# Altium schematic sheet Sheet1.SchDoc
size A3
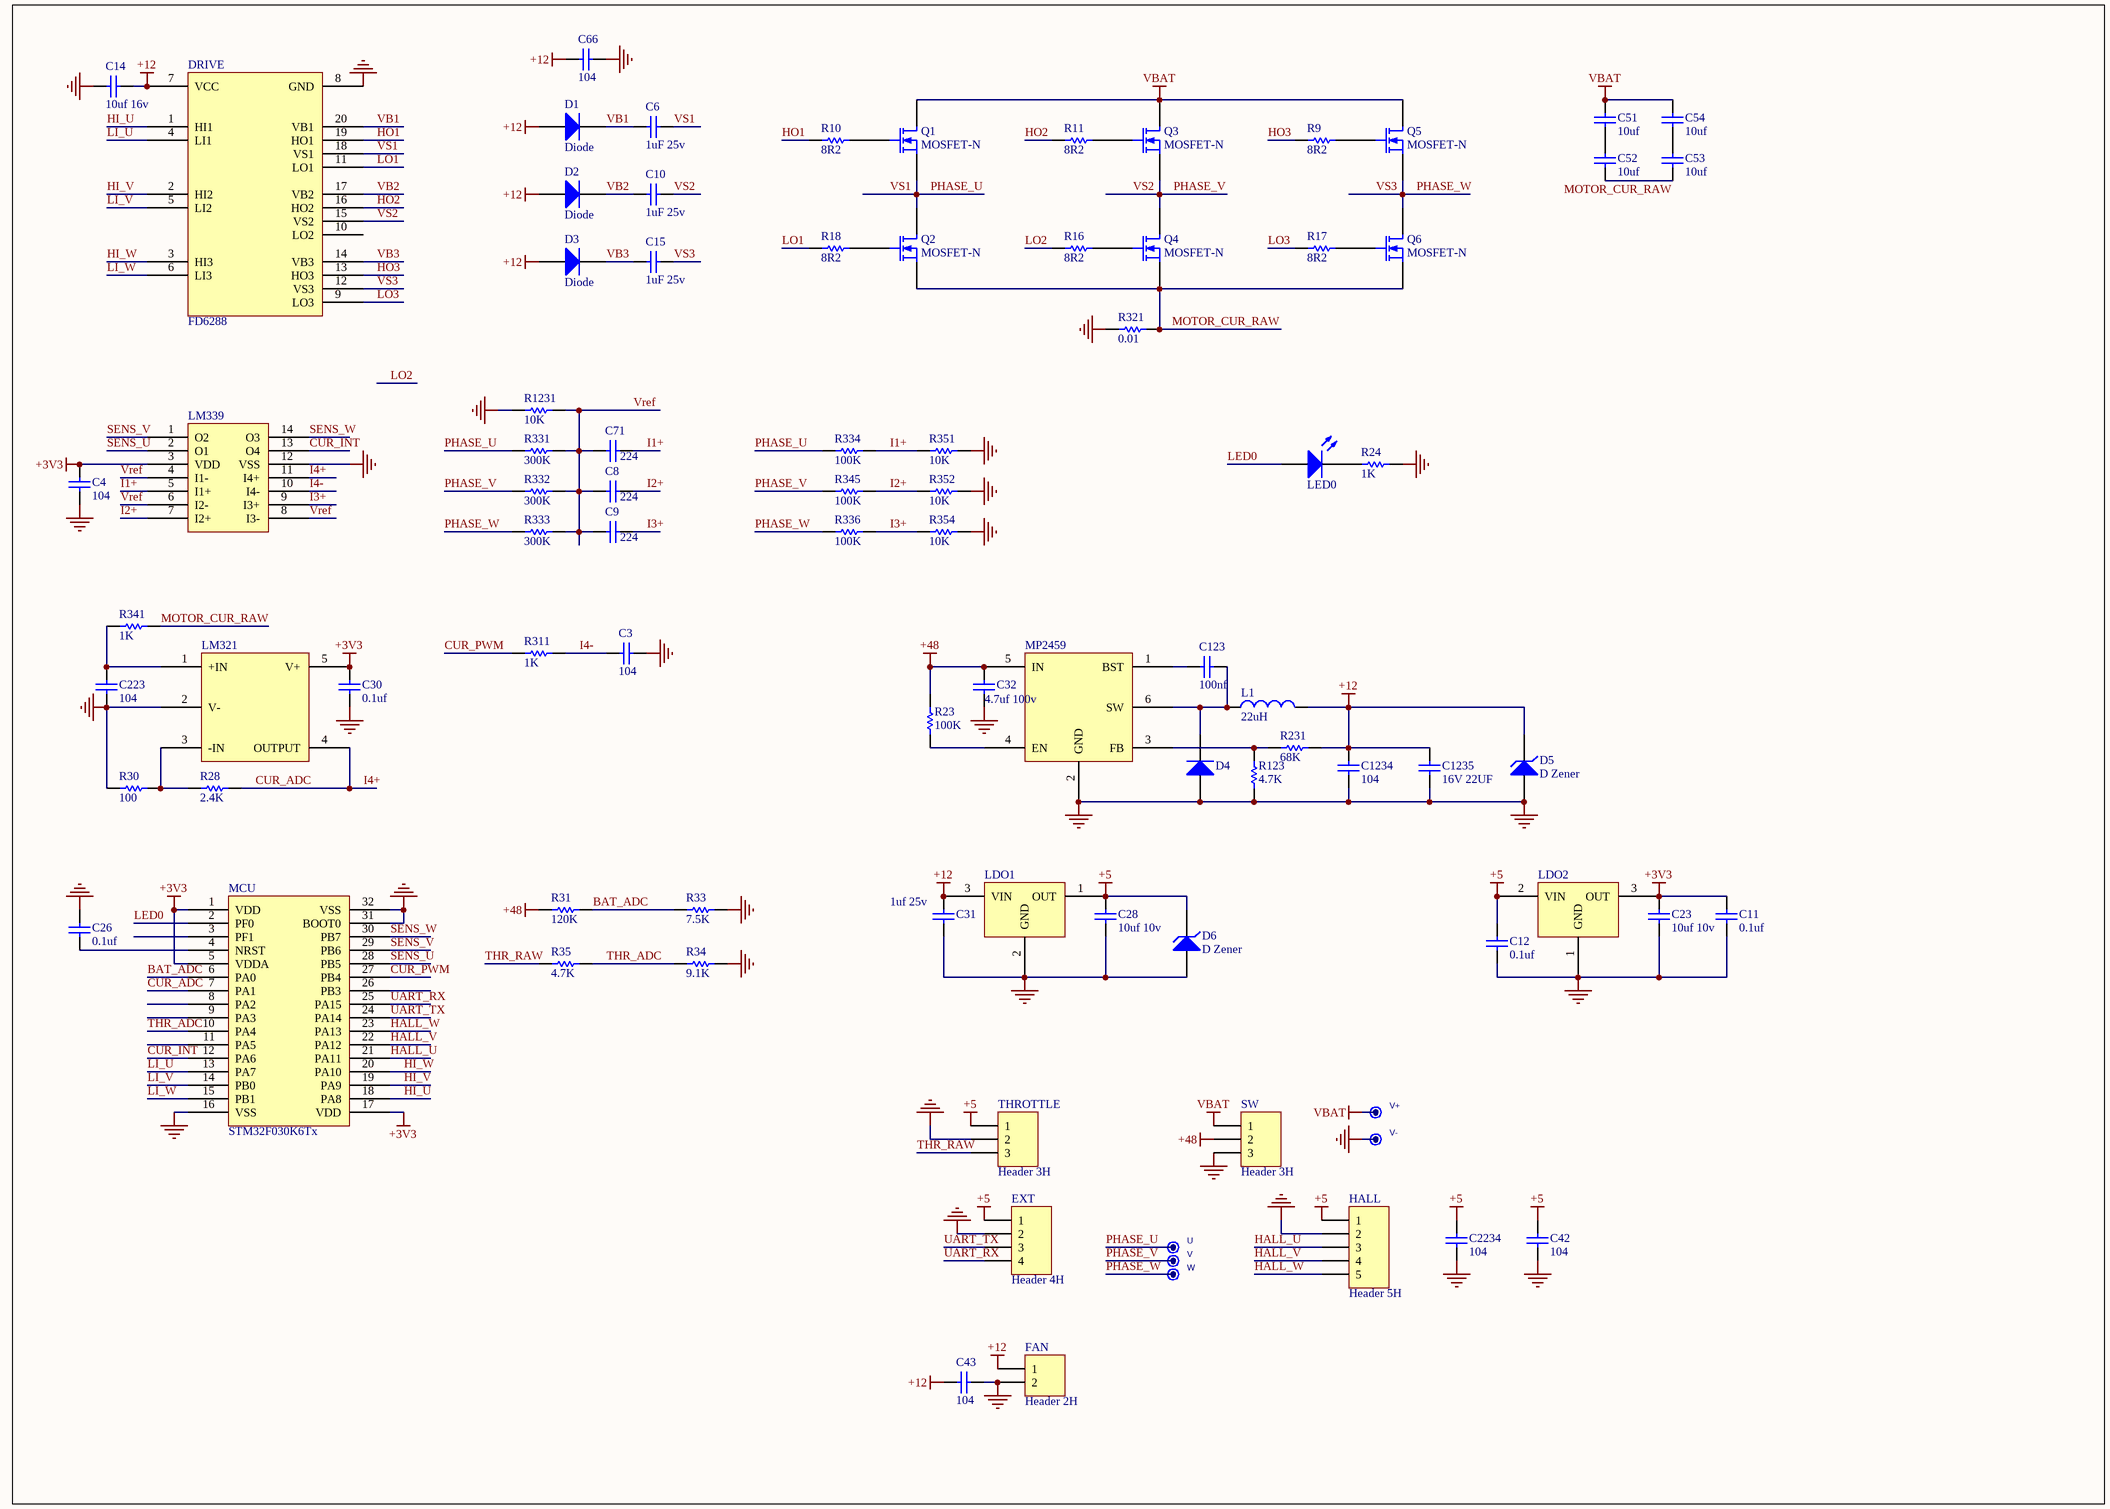
[diagram p0: Sheet1.SchDoc]

## Parts
C3  value 104  [0603]  (hidden comment: Cap)
C4  value 104  [0603]  (hidden comment: Cap)
C6  value 1uF 25v  [0603]  (hidden comment: Cap)
C8  value 224  [0603]  (hidden comment: Cap)
C9  value 224  [0603]  (hidden comment: Cap)
C10  value 1uF 25v  [0603]  (hidden comment: Cap)
C11  value 0.1uf  [0603]  (hidden comment: Cap)
C12  value 0.1uf  [0603]  (hidden comment: Cap)
C14  value 10uf 16v  [0603]  (hidden comment: Cap)
C15  value 1uF 25v  [0603]  (hidden comment: Cap)
C23  value 10uf 10v  [0603]  (hidden comment: Cap)
C26  value 0.1uf  [0603]  (hidden comment: Cap)
C28  value 10uf 10v  [0603]  (hidden comment: Cap)
C30  value 0.1uf  [0603]  (hidden comment: Cap)
C31  value 1uf 25v  [0603]  (hidden comment: Cap)
C32  value 4.7uf 100v  [1206]  (hidden comment: Cap)
C42  value 104  [0603]  (hidden comment: Cap)
C43  value 104  [0603]  (hidden comment: Cap)
C51  value 10uf  [1206]  (hidden comment: Cap)
C52  value 10uf  [1206]  (hidden comment: Cap)
C53  value 10uf  [1206]  (hidden comment: Cap)
C54  value 10uf  [1206]  (hidden comment: Cap)
C66  value 104  [0603]  (hidden comment: Cap)
C71  value 224  [0603]  (hidden comment: Cap)
C123  value 100nf  [0603]  (hidden comment: Cap)
C223  value 104  [0603]  (hidden comment: Cap)
C1234  value 104  [0603]  (hidden comment: Cap)
C1235  value 16V 22UF  [1206]  (hidden comment: Cap)
C2234  value 104  [0603]  (hidden comment: Cap)
D1  Diode  [0603]
D2  Diode  [0603]
D3  Diode  [0603]
D4  Diode  [1206]  (value not drawn)
D5  D Zener  [1206]
D6  D Zener  [1206]
DRIVE  FD6288  [TSSOP20]
EXT  Header 4H  [HDR1X4H]
FAN  Header 2H  [HDR1X2H]
HALL  Header 5H  [HDR1X5H]
L1  value 22uH  [CDRH4D28]  (hidden comment: Inductor)
LDO1  78L05  [SOT-89]  (value not drawn)
LDO2  XC6206  [SOT23]  (value not drawn)
LED  LED0  [0603]
LM321  LM321  [SOT23-5]  (value not drawn)
LM339  LM339  [SOP14]  (value not drawn)
MCU  STM32F030K6Tx  [LQFP-32]
MP2459  MP2459  [SOT23-6]  (value not drawn)
Q1  MOSFET-N  [TO220-MIX]
Q2  MOSFET-N  [TO220-MIX]
Q3  MOSFET-N  [TO220-MIX]
Q4  MOSFET-N  [TO220-MIX]
Q5  MOSFET-N  [TO220-MIX]
Q6  MOSFET-N  [TO220-MIX]
R9  value 8R2  [0603]  (hidden comment: Res1)
R10  value 8R2  [0603]  (hidden comment: Res1)
R11  value 8R2  [0603]  (hidden comment: Res1)
R16  value 8R2  [0603]  (hidden comment: Res1)
R17  value 8R2  [0603]  (hidden comment: Res1)
R18  value 8R2  [0603]  (hidden comment: Res1)
R23  value 100K  [0603]  (hidden comment: Res1)
R24  value 1K  [0603]  (hidden comment: Res1)
R28  value 2.4K  [0603]  (hidden comment: Res1)
R30  value 100  [0603]  (hidden comment: Res1)
R31  value 120K  [0603]  (hidden comment: Res1)
R33  value 7.5K  [0603]  (hidden comment: Res1)
R34  value 9.1K  [0603]  (hidden comment: Res1)
R35  value 4.7K  [0603]  (hidden comment: Res1)
R123  value 4.7K  [0603]  (hidden comment: Res1)
R231  value 68K  [0603]  (hidden comment: Res1)
R311  value 1K  [0603]  (hidden comment: Res1)
R321  value 0.01  [1206]  (hidden comment: Res1)
R331  value 300K  [0603]  (hidden comment: Res1)
R332  value 300K  [0603]  (hidden comment: Res1)
R333  value 300K  [0603]  (hidden comment: Res1)
R334  value 100K  [0603]  (hidden comment: Res1)
R336  value 100K  [0603]  (hidden comment: Res1)
R341  value 1K  [0603]  (hidden comment: Res1)
R345  value 100K  [0603]  (hidden comment: Res1)
R351  value 10K  [0603]  (hidden comment: Res1)
R352  value 10K  [0603]  (hidden comment: Res1)
R354  value 10K  [0603]  (hidden comment: Res1)
R1231  value 10K  [0603]  (hidden comment: Res1)
SW  Header 3H  [HDR1X3H]
THROTTLE  Header 3H  [HDR1X3H]
U  TPS50mil  [PHASE]  (value not drawn)  (no BOM)
V  TPS50mil  [PHASE]  (value not drawn)  (no BOM)
V+  TPS50mil  [PHASE]  (value not drawn)  (no BOM)
V-  TPS50mil  [PHASE]  (value not drawn)  (no BOM)
W  TPS50mil  [PHASE]  (value not drawn)  (no BOM)

## Nets
+3V3: C4.2 C11.1 C23.1 C30.1 LDO2.3(OUT) LM321.5(V+) LM339.3(VDD) MCU.1(VDD) MCU.5(VDDA) MCU.17(VDD)
+5: C12.1 C28.1 C42.1 C2234.1 D6.2(K) EXT.1 HALL.1 LDO1.1(OUT) LDO2.2(VIN) THROTTLE.1
+12: C14.2 C31.1 C43.1 C66.1 C1234.1 C1235.1 D1.1(A) D2.1(A) D3.1(A) D5.2(K) DRIVE.7(VCC) FAN.1 L1.2 LDO1.3(VIN) R231.2
+48: C32.1 MP2459.5(IN) R23.1 R31.1 SW.2
GND: C3.2 C4.1 C11.2 C12.2 C14.1 C23.2 C26.1 C28.2 C30.2 C31.2 C32.2 C42.2 C43.2 C66.2 C223.2 C1234.2 C1235.2 C2234.2 D4.1(A) D5.1(A) D6.1(A) DRIVE.8(GND) EXT.2 FAN.2 HALL.2 LDO1.2(GND) LDO2.1(GND) LM321.2(V-) LM339.12(VSS) MCU.16(VSS) MCU.31(BOOT0) MCU.32(VSS) MP2459.2(GND) R24.2 R30.1 R33.2 R34.2 R123.2 R321.2 R351.1 R352.1 R354.1 R1231.2 SW.3 THROTTLE.2 V-.1
VBAT: C51.1 C54.1 Q1.1(D) Q3.1(D) Q5.1(D) SW.1 V+.1
BAT_ADC: MCU.6(PA0) R31.2 R33.1
CUR_ADC: LM321.4(OUTPUT) LM339.11(I4+) MCU.7(PA1) R28.2  [also labelled I4+]
CUR_INT: LM339.13(O4) MCU.12(PA6)
CUR_PWM: MCU.27(PB4) R311.2
HALL_U: HALL.3 MCU.21(PA11)
HALL_V: HALL.4 MCU.22(PA12)
HALL_W: HALL.5 MCU.23(PA13)
HI_U: DRIVE.1(HI1) MCU.18(PA8)
HI_V: DRIVE.2(HI2) MCU.19(PA9)
HI_W: DRIVE.3(HI3) MCU.20(PA10)
HO1: DRIVE.19(HO1) R10.2
HO2: DRIVE.16(HO2) R11.2
HO3: DRIVE.13(HO3) R9.2
I1+: C71.1 LM339.5(I1+) R334.2 R351.2
I2+: C8.1 LM339.7(I2+) R345.2 R352.2
I3+: C9.1 LM339.9(I3+) R336.2 R354.2
I4-: C3.1 LM339.10(I4-) R311.1
LED0: LED.1(A) MCU.2(PF0)
LI_U: DRIVE.4(LI1) MCU.13(PA7)
LI_V: DRIVE.5(LI2) MCU.14(PB0)
LI_W: DRIVE.6(LI3) MCU.15(PB1)
LO1: DRIVE.11(LO1) R18.2
LO2: R16.2
LO3: DRIVE.9(LO3) R17.2
MOTOR_CUR_RAW: C52.2 C53.2 Q2.3(S) Q4.3(S) Q6.3(S) R321.1 R341.1
PHASE_U: C6.1 DRIVE.18(VS1) Q1.3(S) Q2.1(D) R331.1 R334.1 U.1  [also labelled VS1]
PHASE_V: C10.1 DRIVE.15(VS2) Q3.3(S) Q4.1(D) R332.1 R345.1 V.1  [also labelled VS2]
PHASE_W: C15.1 DRIVE.12(VS3) Q5.3(S) Q6.1(D) R333.1 R336.1 W.1  [also labelled VS3]
SENS_U: LM339.2(O1) MCU.28(PB5)
SENS_V: LM339.1(O2) MCU.29(PB6)
SENS_W: LM339.14(O3) MCU.30(PB7)
THR_ADC: MCU.10(PA4) R34.1 R35.2
THR_RAW: R35.1 THROTTLE.3
UART_RX: EXT.4 MCU.25(PA15)
UART_TX: EXT.3 MCU.24(PA14)
VB1: C6.2 D1.2(K) DRIVE.20(VB1)
VB2: C10.2 D2.2(K) DRIVE.17(VB2)
VB3: C15.2 D3.2(K) DRIVE.14(VB3)
Vref: C8.2 C9.2 C71.2 LM339.4(I1-) LM339.6(I2-) LM339.8(I3-) R331.2 R332.2 R333.2 R1231.1
NetC26_2: C26.2 MCU.4(NRST)
NetC51_2: C51.2 C52.1
NetC53_1: C53.1 C54.2
NetC123_1: C123.1 MP2459.1(BST)
NetC123_2: C123.2 D4.2(K) L1.1 MP2459.6(SW)
NetC223_1: C223.1 LM321.1(+IN) R341.2
NetLED_2: LED.2(K) R24.1
NetLM321_3: LM321.3(-IN) R28.1 R30.2
NetMP2459_3: MP2459.3(FB) R123.1 R231.1
NetMP2459_4: MP2459.4(EN) R23.2
NetQ1_2: Q1.2(G) R10.1
NetQ2_2: Q2.2(G) R18.1
NetQ3_2: Q3.2(G) R11.1
NetQ4_2: Q4.2(G) R16.1
NetQ5_2: Q5.2(G) R9.1
NetQ6_2: Q6.2(G) R17.1

Not connected (* = marked no-connect by the designer): DRIVE 10(LO2); MCU 3(PF1) 8(PA2) 9(PA3) 11(PA5) 26(PB3)

## Library data of the parts
C3 C4 C6 C8-C12 C14 C15 C23 C26 C28 C30-C32 C42 C43 C51-C54 C66 C71 C123 C223 C1234 C1235 C2234 = Cap: Capacitor; Published: 8-Jun-2000; LatestRevisionDate: 17-Jul-2002; LatestRevisionNote: Re-released for DXP Platform.; PackageReference: RAD-0.3; Publisher: Altium Limited; PackageDescription: Radial Cap, Thru-Hole; 2 Leads; 0.3 in Pin Spacing
D1-D4 = Diode: Default Diode; Published: 8-Jun-2000; LatestRevisionDate: 17-Jul-2002; LatestRevisionNote: Re-released for DXP Platform.; PackageVersion: Sep-1996; PackageReference: SMC; Publisher: Altium Limited; PackageDescription: DO-214-AB/SMC; 2 C-Bend Leads; Body 7.9 x 5.9 mm, inc. leads (LxW); Code_JEDEC: DO-214-AB
D5 D6 = D Zener: Zener Diode; Published: 8-Jun-2000; LatestRevisionDate: 17-Jul-2002; LatestRevisionNote: Re-released for DXP Platform.; PackageReference: DIODE-0.7; Publisher: Altium Limited; PackageDescription: Diode, Thru-Hole; 2 Leads; 0.7 in Pin Spacing
EXT = Header 4H: Header, 4-Pin, Right Angle; LatestRevisionDate: 17-Jul-2002; LatestRevisionNote: Re-released for DXP Platform.; Publisher: Altium Limited
FAN = Header 2H: Header, 2-Pin, Right Angle; LatestRevisionDate: 17-Jul-2002; LatestRevisionNote: Re-released for DXP Platform.; Publisher: Altium Limited
HALL = Header 5H: Header, 5-Pin, Right Angle; LatestRevisionDate: 17-Jul-2002; LatestRevisionNote: Re-released for DXP Platform.; Publisher: Altium Limited
L1 = Inductor: Code_IEC: 1005; Published: 8-Jun-2000; LatestRevisionDate: 29-May-2009; LatestRevisionNote: IPC-7351 Footprint Added.; PackageReference: 0402-A; Publisher: Altium Limited; PackageDescription: Chip Inductor; Code_JEITA: 0402
LDO2 = HT75xx
LED = LED0: Typical INFRARED GaAs LED; Published: 8-Jun-2000; LatestRevisionDate: 08-Jul-2005; LatestRevisionNote: Mech Layer 1 removed.; PackageReference: LED-0; Publisher: Altium Limited; PackageDescription: LED; 2 Leads
Q1-Q6 = MOSFET-N: N-Channel MOSFET; pin to pad: 1>2 2>1; Published: 8-Jun-2000; LatestRevisionDate: 17-Jul-2002; LatestRevisionNote: Re-released for DXP Platform.; PackageVersion: 1995/1996; PackageReference: E3; Publisher: Altium Limited; PackageDescription: TO, Flat Index; 3 In-Line, Axial Leads; Body Dia. 4.6mm; Lead Dia. 0.5 mm (max)
R9-R11 R16-R18 R23 R24 R28 R30 R31 R33-R35 R123 R231 R311 R321 R331-R334 R336 R341 R345 R351 R352 R354 R1231 = Res1: Resistor; Published: 8-Jun-2000; LatestRevisionDate: 17-Jul-2002; LatestRevisionNote: Re-released for DXP Platform.; PackageReference: AXIAL-0.3; Publisher: Altium Limited; PackageDescription: Axial Device, Thru-Hole; 2 Leads; 0.3 in Pin Spacing
SW THROTTLE = Header 3H: Header, 3-Pin, Right Angle; LatestRevisionDate: 17-Jul-2002; LatestRevisionNote: Re-released for DXP Platform.; Publisher: Altium Limited
U V V+ V- W = TPS50mil: Test Point, 12x25mil, Not Populated